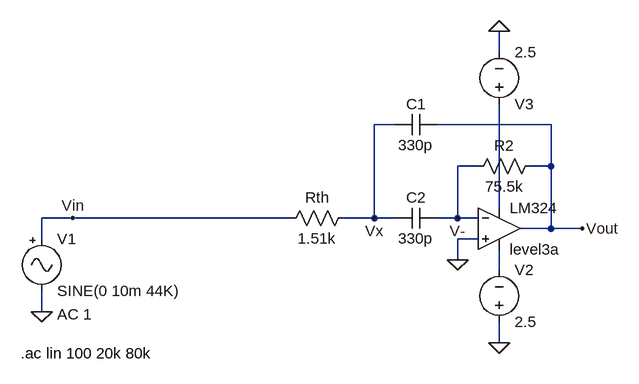
[diagram p0: schematic vcvs-example-01.asc]
vcvs-example-01.asc, the LTspice schematic file:
Version 4
SHEET 1 880 680
WIRE 256 -176 256 -208
WIRE 96 -64 64 -64
WIRE 336 -64 160 -64
WIRE 224 0 192 0
WIRE 336 0 336 -64
WIRE 336 0 304 0
WIRE 256 64 256 -96
WIRE -400 80 -448 80
WIRE -64 80 -400 80
WIRE 64 80 64 -64
WIRE 64 80 16 80
WIRE 96 80 64 80
WIRE 192 80 192 0
WIRE 192 80 160 80
WIRE 224 80 192 80
WIRE 336 96 336 0
WIRE 336 96 288 96
WIRE 384 96 336 96
WIRE -448 112 -448 80
WIRE 224 112 192 112
WIRE 192 144 192 112
WIRE 256 160 256 128
WIRE -448 224 -448 192
WIRE 256 272 256 240
FLAG 64 80 Vx
FLAG 192 80 V-
FLAG 192 144 0
FLAG 384 96 Vout
FLAG -448 224 0
FLAG -400 80 Vin
FLAG 256 -208 0
FLAG 256 272 0
SYMBOL Misc\\signal -448 96 R0
WINDOW 123 24 132 Left 2
WINDOW 39 0 0 Left 0
SYMATTR Value2 AC 1
SYMATTR InstName V1
SYMATTR Value SINE(0 10m 44K)
SYMBOL res 32 64 R90
WINDOW 0 0 56 VBottom 2
WINDOW 3 32 56 VTop 2
SYMATTR InstName Rth
SYMATTR Value 1.51k
SYMBOL cap 160 -80 R90
WINDOW 0 0 32 VBottom 2
WINDOW 3 32 32 VTop 2
SYMATTR InstName C1
SYMATTR Value 330p
SYMBOL cap 160 64 R90
WINDOW 0 0 32 VBottom 2
WINDOW 3 32 32 VTop 2
SYMATTR InstName C2
SYMATTR Value 330p
SYMBOL res 320 -16 R90
WINDOW 0 0 56 VBottom 2
WINDOW 3 32 56 VTop 2
SYMATTR InstName R2
SYMATTR Value 75.5k
SYMBOL voltage 256 256 M180
WINDOW 0 24 96 Left 2
WINDOW 3 24 16 Left 2
WINDOW 123 0 0 Left 0
WINDOW 39 0 0 Left 0
SYMATTR InstName V2
SYMATTR Value 2.5
SYMBOL voltage 256 -80 M180
WINDOW 123 0 0 Left 0
WINDOW 39 0 0 Left 0
SYMATTR InstName V3
SYMATTR Value 2.5
SYMBOL Opamps\\UniversalOpAmp3 256 96 R0
SYMATTR InstName LM324
SYMATTR Value2 Avol=100k GBW=1.2Meg Slew=0.5Meg
SYMATTR SpiceLine Ilimit=20m Rail=0 Vos=0 Phimargin=45
TEXT -480 288 Left 2 !.ac lin 100 20k 80k

The netlist it stands for:
* vcvs-example-01.asc
V1 Vin 0 SINE(0 10m 44K) AC 1
Rth Vx Vin 1.51k
C1 Vout Vx 330p
C2 V- Vx 330p
R2 Vout V- 75.5k
V2 0 N002 2.5
V3 N001 0 2.5
XLM324 0 V- N001 N002 Vout level3a Avol=100k GBW=1.2Meg Slew=0.5Meg Ilimit=20m Rail=0 Vos=0 Phimargin=45  ; pins In+ In- V+ V- OUT
.ac lin 100 20k 80k
.backanno
.end